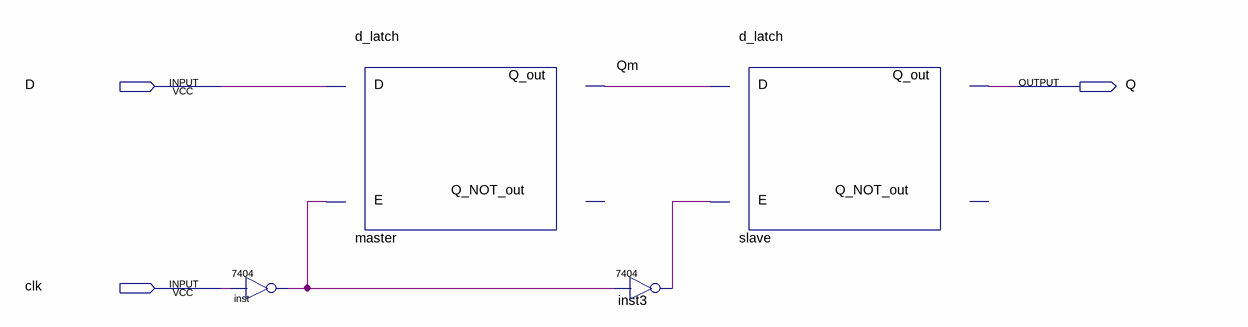
[diagram p0: schematic sheet]
// Quartus schematic d_ff.bdf as structural Verilog: 4 symbols, 3 pins
module d_ff (
  input  D,
  input  clk,
  output Q
);

  wire inst3_1, inst_1, Qm;

  \7404  inst (.\2 (clk), .\1 (inst_1));
  d_latch master (.D(D), .E(inst_1), .Q_out(Qm));  // open: Q_NOT_out
  \7404  inst3 (.\2 (inst_1), .\1 (inst3_1));
  d_latch slave (.D(Qm), .E(inst3_1), .Q_out(Q));  // open: Q_NOT_out
endmodule
